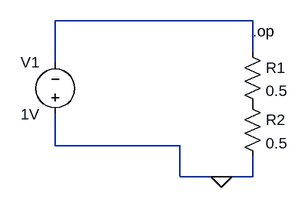
[diagram p0: schematic FlipVSource_seriesR.asc]
FlipVSource_seriesR.asc, the LTspice schematic file:
Version 4
SHEET 1 880 680
WIRE 336 208 32 208
WIRE 336 256 336 208
WIRE 32 272 32 208
WIRE 32 400 32 352
WIRE 224 400 32 400
WIRE 224 448 224 400
WIRE 288 448 224 448
WIRE 336 448 336 416
WIRE 336 448 288 448
FLAG 288 448 0
SYMBOL res 320 240 R0
SYMATTR InstName R1
SYMATTR Value 0.5
SYMBOL res 320 320 R0
SYMATTR InstName R2
SYMATTR Value 0.5
SYMBOL voltage 32 368 R180
WINDOW 0 24 96 Left 2
WINDOW 3 24 16 Left 2
SYMATTR InstName V1
SYMATTR Value 1V
TEXT 336 224 Left 2 !.op

The netlist it stands for:
* FlipVSource_seriesR.asc
R1 N001 P001 0.5
R2 P001 0 0.5
V1 0 N001 1V
.op
.backanno
.end